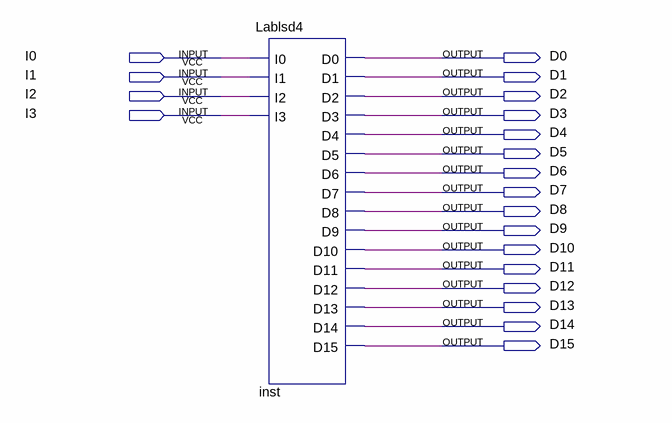
[diagram p0: schematic sheet]
// Quartus schematic Block2.bdf as structural Verilog: 1 symbols, 20 pins
module Block2 (
  input  I0,
  input  I1,
  input  I2,
  input  I3,
  output D0,
  output D1,
  output D2,
  output D3,
  output D4,
  output D5,
  output D6,
  output D7,
  output D8,
  output D9,
  output D10,
  output D11,
  output D12,
  output D13,
  output D14,
  output D15
);

  Lablsd4 inst (
    .I0(I0), .I1(I1), .I2(I2), .I3(I3), .D0(D0), .D1(D1), .D2(D2), .D3(D3), .D4(D4), .D5(D5), .D6(D6),
    .D7(D7), .D8(D8), .D9(D9), .D10(D10), .D11(D11), .D12(D12), .D13(D13), .D14(D14), .D15(D15));
endmodule
